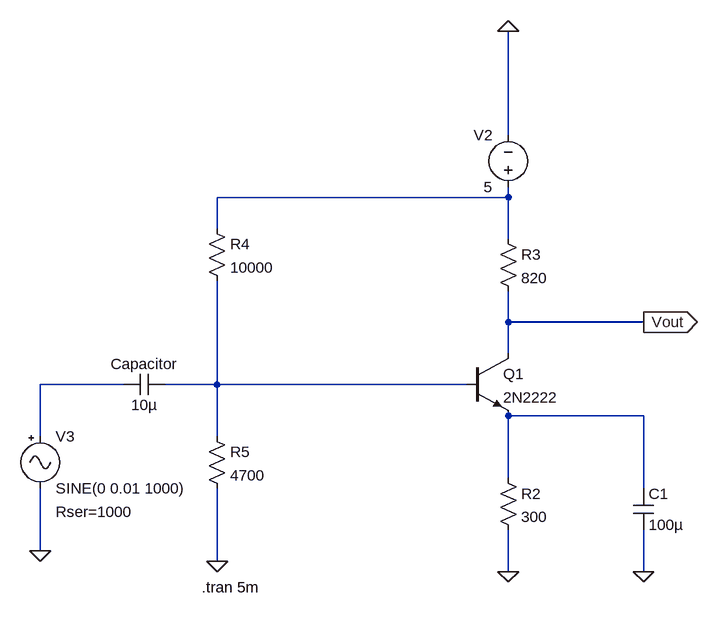
[diagram p0: schematic CE Stage.asc]
CE Stage.asc, the LTspice schematic file:
Version 4.1
SHEET 1 1108 680
WIRE 672 -400 672 -560
WIRE 672 -304 672 -320
WIRE 672 -304 224 -304
WIRE 224 -256 224 -304
WIRE 672 -240 672 -304
WIRE 672 -112 672 -160
WIRE 880 -112 672 -112
WIRE 672 -64 672 -112
WIRE 80 -16 -48 -16
WIRE 224 -16 224 -176
WIRE 224 -16 144 -16
WIRE 608 -16 224 -16
WIRE 880 32 672 32
WIRE -48 64 -48 -16
WIRE 224 64 224 -16
WIRE 672 128 672 32
WIRE 880 144 880 32
WIRE -48 240 -48 144
WIRE 224 256 224 144
WIRE 672 272 672 208
WIRE 880 272 880 208
FLAG 224 256 0
FLAG 672 272 0
FLAG 880 -112 Vout
IOPIN 880 -112 Out
FLAG -48 240 0
FLAG 672 -560 0
FLAG 880 272 0
SYMBOL npn 608 -64 R0
SYMATTR InstName Q1
SYMATTR Value 2N2222
SYMBOL res 656 112 R0
SYMATTR InstName R2
SYMATTR Value 300
SYMBOL res 656 -256 R0
SYMATTR InstName R3
SYMATTR Value 820
SYMBOL voltage 672 -304 R180
WINDOW 0 24 96 Left 2
WINDOW 3 24 16 Left 2
WINDOW 123 0 0 Left 0
WINDOW 39 0 0 Left 0
SYMATTR InstName V2
SYMATTR Value 5
SYMBOL res 208 48 R0
SYMATTR InstName R5
SYMATTR Value 4700
SYMBOL res 208 -272 R0
SYMATTR InstName R4
SYMATTR Value 10000
SYMBOL Misc\\signal -48 48 R0
WINDOW 123 0 0 Left 0
WINDOW 39 24 132 Left 2
SYMATTR InstName V3
SYMATTR Value SINE(0 0.01 1000)
SYMATTR SpiceLine Rser=1000
SYMBOL cap 144 -32 R90
WINDOW 0 0 32 VBottom 2
WINDOW 3 32 32 VTop 2
SYMATTR InstName Capacitor
SYMATTR Value 10µ
SYMBOL cap 864 144 R0
SYMATTR InstName C1
SYMATTR Value 100µ
TEXT 200 296 Left 2 !.tran 5m

The netlist it stands for:
* CE Stage.asc
Q1 Vout N003 N004 0 2N2222
R2 N004 0 300
R3 N001 Vout 820
V2 N001 0 5
R5 N003 0 4700
R4 N001 N003 10000
V3 N002 0 SINE(0 0.01 1000) Rser=1000
Capacitor N003 N002 10µ
C1 N004 0 100µ
.model NPN NPN
.model PNP PNP
.lib standard.bjt
.tran 5m
.backanno
.end